# Altium schematic sheet CPU.SchDoc
size A3; Date: 2026/04/16; ApprovedBy: NA; Author: 邱上峯; CompanyName: JFM常裕富士機工; Engineer: 邱上峯; Revision: V1.0; SheetNumber: 2; SheetTotal: 8; Pcb Name: NA
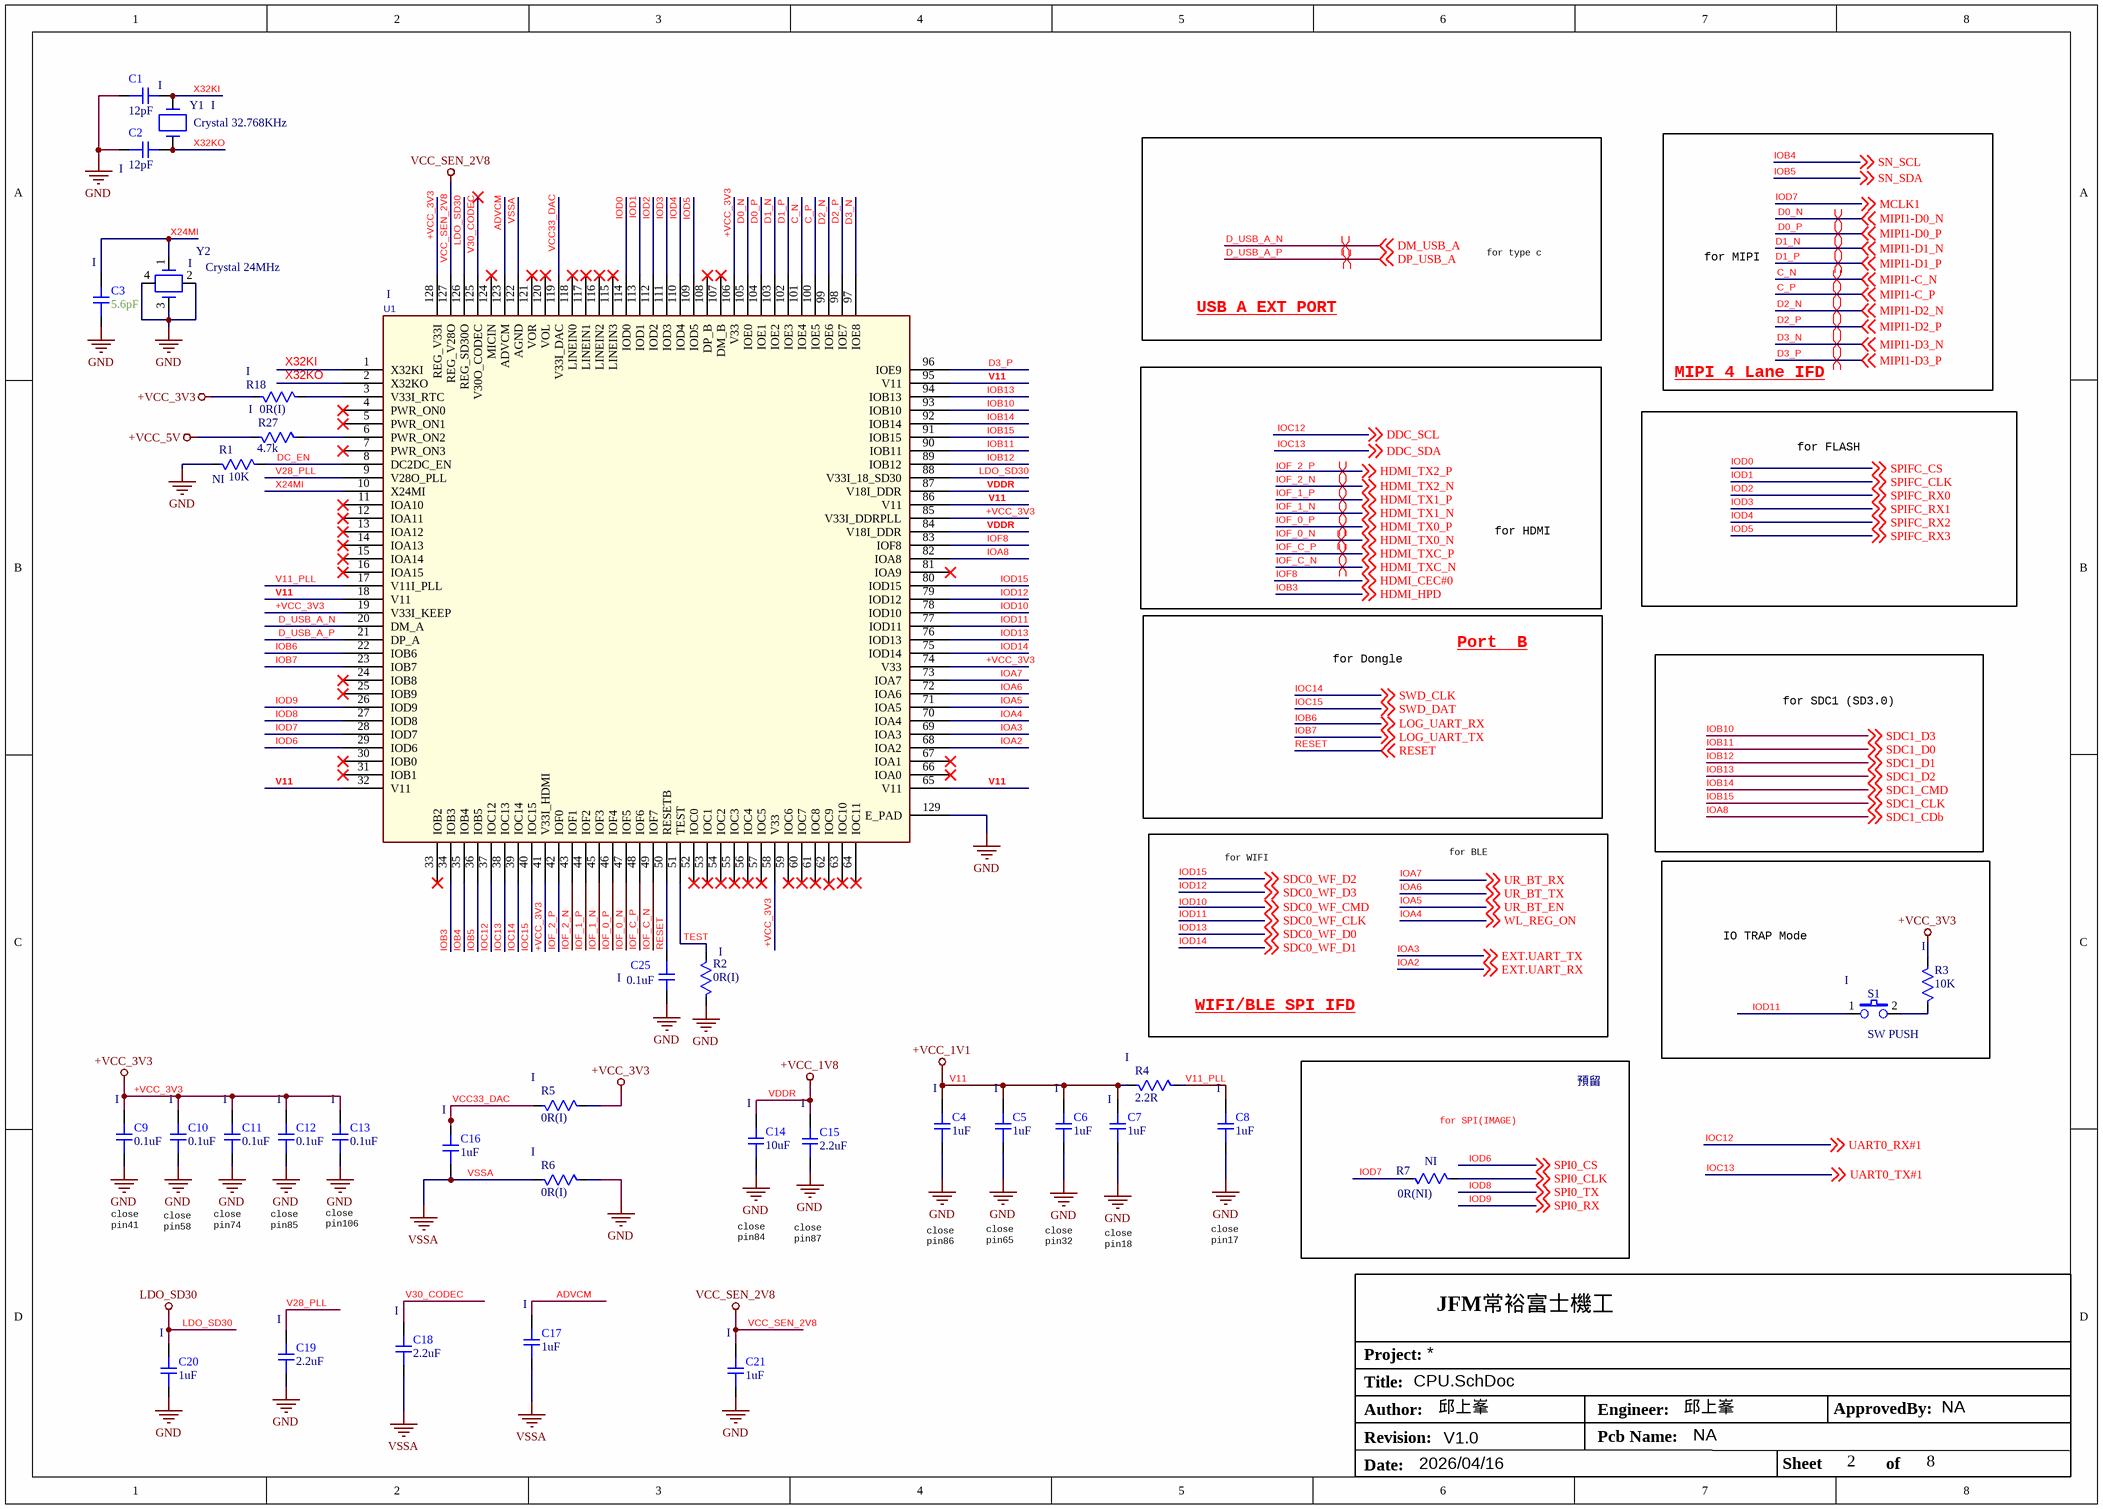
[diagram p0: CPU.SchDoc]

## Parts
C1  12pF  BOM: I  [C0402]
C2  12pF  BOM: I  [C0402]
C3  5.6pF  BOM: I  [C0402]
C4  1uF  BOM: I  [C0402]
C5  1uF  BOM: I  [C0402]
C6  1uF  BOM: I  [C0402]
C7  1uF  BOM: I  [C0402]
C8  1uF  BOM: I  [C0402]
C9  0.1uF  BOM: I  [C0402]
C10  0.1uF  BOM: I  [C0402]
C11  0.1uF  BOM: I  [C0402]
C12  0.1uF  BOM: I  [C0402]
C13  0.1uF  BOM: I  [C0402]
C14  10uF  BOM: I  [C0603]
C15  2.2uF  BOM: I  [C0402]
C16  1uF  BOM: I  [C0402]
C17  1uF  BOM: I  [C0402]
C18  2.2uF  BOM: I  [C0402]
C19  2.2uF  BOM: I  [C0402]
C20  1uF  BOM: I  [C0402]
C21  1uF  BOM: I  [C0402]
C25  0.1uF  BOM: I  [C0402]
R1  10K  BOM: NI  [R0603]
R2  0R(I)  BOM: I  [R0402]
R3  10K  BOM: I  [R0402]
R4  2.2R  BOM: I  [R0603]
R5  0R(I)  BOM: I  [R0402]
R6  0R(I)  BOM: I  [R0402]
R7  0R(NI)  BOM: NI  [R0402]
R18  0R(I)  BOM: I  [R0402]
R27  4.7k  BOM: I  [R0402]
S1  SW PUSH  BOM: I  [Surface Mount Right Angle Switch]
U1  BOM: I  [TQFP128P 1600X1600X160-129N]  (hidden comment: GPA7740A-LQFP128-EP)
Y1  Crystal 32.768KHz  BOM: I  [Crystal 32.768KHz]
Y2  Crystal 24MHz  BOM: I  [Crystal 24MHz]

## Blocks framed on the sheet
IO TRAP Mode: R3 S1
預留: R7

## Nets
+VCC_3V3: C9.2 C10.2 C11.2 C12.2 C13.2 R3.1 R5.2 R18.2 U1.19(V33I_KEEP) U1.41(V33I_HDMI) U1.58(V33) U1.74(V33) U1.85(V33I_DDRPLL) U1.106(V33) U1.128(REG_V33I)
+VCC_5V: R27.2
GND: C1.1 C2.1 C3.1 C4.1 C5.1 C6.1 C7.1 C8.1 C9.1 C10.1 C11.1 C12.1 C13.1 C14.1 C15.1 C19.1 C20.1 C21.1 C25.2 R1.2 R2.1 R6.2 U1.129(E_PAD) Y2.2 Y2.3 Y2.4
LDO_SD30: C20.2 U1.88(V33I_18_SD30) U1.126(REG_SD30O)
V11: C4.2 C5.2 C6.2 C7.2 R4.1 U1.18(V11) U1.32(V11) U1.65(V11) U1.86(V11) U1.95(V11)  [also labelled +VCC_1V1]
VCC_SEN_2V8: C21.2 U1.127(REG_V28O)
VDDR: C14.2 C15.2 U1.84(V18I_DDR) U1.87(V18I_DDR)  [also labelled +VCC_1V8]
VSSA: C16.1 C17.1 C18.1 R6.1 U1.122(AGND)
ADVCM: C17.2 U1.123(ADVCM)
C_N: U1.101(IOE4) ; off-sheet MIPI1-C_N  [also labelled MIPI1-C_N]
C_P: U1.100(IOE5) ; off-sheet MIPI1-C_P  [also labelled MIPI1-C_P]
D0_N: U1.105(IOE0) ; off-sheet MIPI1-D0_N  [also labelled MIPI1-D0_N]
D0_P: U1.104(IOE1) ; off-sheet MIPI1-D0_P  [also labelled MIPI1-D0_P]
D1_N: U1.103(IOE2) ; off-sheet MIPI1-D1_N  [also labelled MIPI1-D1_N]
D1_P: U1.102(IOE3) ; off-sheet MIPI1-D1_P  [also labelled MIPI1-D1_P]
D2_N: U1.99(IOE6) ; off-sheet MIPI1-D2_N  [also labelled MIPI1-D2_N]
D2_P: U1.98(IOE7) ; off-sheet MIPI1-D2_P  [also labelled MIPI1-D2_P]
D3_N: U1.97(IOE8) ; off-sheet MIPI1-D3_N  [also labelled MIPI1-D3_N]
D3_P: U1.96(IOE9) ; off-sheet MIPI1-D3_P  [also labelled MIPI1-D3_P]
D_USB_A_N: U1.20(DM_A) ; off-sheet DM_USB_A  [also labelled DM_USB_A]
D_USB_A_P: U1.21(DP_A) ; off-sheet DP_USB_A  [also labelled DP_USB_A]
DC_EN: R1.1 U1.8(DC2DC_EN)
IOA2: U1.68(IOA2) ; off-sheet EXT.UART_RX  [also labelled EXT.UART_RX]
IOA3: U1.69(IOA3) ; off-sheet EXT.UART_TX  [also labelled EXT.UART_TX]
IOA4: U1.70(IOA4) ; off-sheet WL_REG_ON  [also labelled WL_REG_ON]
IOA5: U1.71(IOA5) ; off-sheet UR_BT_EN  [also labelled UR_BT_EN]
IOA6: U1.72(IOA6) ; off-sheet UR_BT_TX  [also labelled UR_BT_TX]
IOA7: U1.73(IOA7) ; off-sheet UR_BT_RX  [also labelled UR_BT_RX]
IOA8: U1.82(IOA8) ; off-sheet SDC1_CDb  [also labelled SDC1_CDb]
IOB3: U1.34(IOB3) ; off-sheet HDMI_HPD  [also labelled HDMI_HPD]
IOB4: U1.35(IOB4) ; off-sheet SN_SCL  [also labelled SN_SCL]
IOB5: U1.36(IOB5) ; off-sheet SN_SDA  [also labelled SN_SDA]
IOB6: U1.22(IOB6)
IOB7: U1.23(IOB7) ; off-sheet LOG_UART_TX  [also labelled LOG_UART_TX]
IOB10: U1.93(IOB10) ; off-sheet SDC1_D3  [also labelled SDC1_D3]
IOB11: U1.90(IOB11) ; off-sheet SDC1_D0  [also labelled SDC1_D0]
IOB12: U1.89(IOB12) ; off-sheet SDC1_D1  [also labelled SDC1_D1]
IOB13: U1.94(IOB13) ; off-sheet SDC1_D2  [also labelled SDC1_D2]
IOB14: U1.92(IOB14) ; off-sheet SDC1_CMD  [also labelled SDC1_CMD]
IOB15: U1.91(IOB15) ; off-sheet SDC1_CLK  [also labelled SDC1_CLK]
IOC12: U1.37(IOC12) ; off-sheet DDC_SCL, off-sheet UART0_RX#1  [also labelled DDC_SCL, UART0_RX#1]
IOC13: U1.38(IOC13) ; off-sheet DDC_SDA, off-sheet UART0_TX#1  [also labelled DDC_SDA, UART0_TX#1]
IOC14: U1.39(IOC14) ; off-sheet SWD_CLK  [also labelled SWD_CLK]
IOC15: U1.40(IOC15) ; off-sheet SWD_DAT  [also labelled SWD_DAT]
IOD0: U1.114(IOD0) ; off-sheet SPIFC_CS  [also labelled SPIFC_CS]
IOD1: U1.113(IOD1) ; off-sheet SPIFC_CLK  [also labelled SPIFC_CLK]
IOD2: U1.112(IOD2) ; off-sheet SPIFC_RX0  [also labelled SPIFC_RX0]
IOD3: U1.111(IOD3) ; off-sheet SPIFC_RX1  [also labelled SPIFC_RX1]
IOD4: U1.110(IOD4) ; off-sheet SPIFC_RX2  [also labelled SPIFC_RX2]
IOD5: U1.109(IOD5) ; off-sheet SPIFC_RX3  [also labelled SPIFC_RX3]
IOD6: U1.29(IOD6) ; off-sheet SPI0_CS  [also labelled SPI0_CS]
IOD7: R7.1 U1.28(IOD7) ; off-sheet MCLK1  [also labelled MCLK1]
IOD8: U1.27(IOD8) ; off-sheet SPI0_TX  [also labelled SPI0_TX]
IOD9: U1.26(IOD9) ; off-sheet SPI0_RX  [also labelled SPI0_RX]
IOD10: U1.78(IOD10)
IOD11: S1.1 U1.77(IOD11) ; off-sheet SDC0_WF_CLK  [also labelled SDC0_WF_CLK]
IOD12: U1.79(IOD12) ; off-sheet SDC0_WF_D3  [also labelled SDC0_WF_D3]
IOD13: U1.76(IOD13) ; off-sheet SDC0_WF_D0  [also labelled SDC0_WF_D0]
IOD14: U1.75(IOD14) ; off-sheet SDC0_WF_D1  [also labelled SDC0_WF_D1]
IOD15: U1.80(IOD15) ; off-sheet SDC0_WF_D2  [also labelled SDC0_WF_D2]
IOF8: U1.83(IOF8) ; off-sheet HDMI_CEC#0  [also labelled HDMI_CEC#0]
IOF_0_N: U1.47(IOF5) ; off-sheet HDMI_TX0_N  [also labelled HDMI_TX0_N]
IOF_0_P: U1.46(IOF4) ; off-sheet HDMI_TX0_P  [also labelled HDMI_TX0_P]
IOF_1_N: U1.45(IOF3) ; off-sheet HDMI_TX1_N  [also labelled HDMI_TX1_N]
IOF_1_P: U1.44(IOF2) ; off-sheet HDMI_TX1_P  [also labelled HDMI_TX1_P]
IOF_2_N: U1.43(IOF1) ; off-sheet HDMI_TX2_N  [also labelled HDMI_TX2_N]
IOF_2_P: U1.42(IOF0)
IOF_C_N: U1.49(IOF7) ; off-sheet HDMI_TXC_N  [also labelled HDMI_TXC_N]
IOF_C_P: U1.48(IOF6) ; off-sheet HDMI_TXC_P  [also labelled HDMI_TXC_P]
RESET: C25.1 U1.50(RESETB) ; off-sheet RESET
SPI0_CLK: R7.2 ; off-sheet SPI0_CLK
TEST: R2.2 U1.51(TEST)
V11_PLL: C8.2 R4.2 U1.17(V11I_PLL)
V28_PLL: C19.2 U1.9(V28O_PLL)
V30_CODEC: C18.2 U1.125(V30O_CODEC)
VCC33_DAC: C16.2 R5.1 U1.119(V33I_DAC)
X24MI: C3.2 U1.10(X24MI) Y2.1
X32KI: C1.2 U1.1(X32KI) Y1.2
X32KO: C2.2 U1.2(X32KO) Y1.1
NetR3_2: R3.2 S1.2
NetR18_1: R18.1 U1.3(V33I_RTC)
NetR27_1: R27.1 U1.6(PWR_ON2)

Not connected (* = marked no-connect by the designer): U1 4(PWR_ON0)* 5(PWR_ON1)* 7(PWR_ON3)* 11(IOA10)* 12(IOA11)* 13(IOA12)* 14(IOA13)* 15(IOA14)* 16(IOA15)* 24(IOB8)* 25(IOB9)* 30(IOB0)* 31(IOB1)* 33(IOB2)* 52(IOC0)* 53(IOC1)* 54(IOC2)* 55(IOC3)* 56(IOC4)* 57(IOC5)* 59(IOC6)* 60(IOC7)* 61(IOC8)* 62(IOC9) 63(IOC10)* 64(IOC11)* 66(IOA0)* 67(IOA1)* 81(IOA9)* 107(DM_B)* 108(DP_B)* 115(LINEIN3)* 116(LINEIN2)* 117(LINEIN1)* 118(LINEIN0)* 120(VOL)* 121(VOR)* 124(MICIN)*

## Layout directives
differential pair: C_N, C_P, D0_N, D0_P, D1_N, D1_P, D2_N, D2_P, D3_N, D3_P, D_USB_A_N, D_USB_A_P, HDMI_TX2_P, IOF_0_N, IOF_0_P, IOF_1_N, IOF_1_P, IOF_2_N, IOF_C_N, IOF_C_P

## Notes on the sheet
- USB A EXT PORT
- for type c
- for MIPI
- MIPI 4 Lane IFD
- for FLASH
- for HDMI
- Port  B
- for Dongle
- for SDC1 (SD3.0)
- for BLE
- for WIFI
- WIFI/BLE SPI IFD
- (near R7) for SPI(IMAGE)
- close
  pin41
- close
  pin58
- close
  pin74
- close
  pin85
- close
  pin106
- close
  pin84
- close
  pin87
- close
  pin86
- close
  pin65
- close
  pin32
- close
  pin18
- close
  pin17
- Labels drawn without touching a wire or pin: IOB6, IOD10, IOF_2_P
- Title:
- Project:
- Date:
- Author:
- Revision:
- Engineer:
- Pcb Name:
- Sheet
- ApprovedBy:
- of

## Library data of the parts
C1-C21 C25 = Cap
R1-R7 R18 R27 = Res
Y1 = Crystal 32.768KHz: Q-SC20S03220C5AAAF,SEIKO,l32.768KHz,12.5PF,20ppm,2.05x1.2mm
Y2 = Crystal 24MHz: XRCGE24M000FBA1BR0,MURATA,24.0000MHZ,8PF,15PPM,2.0x1.6mm